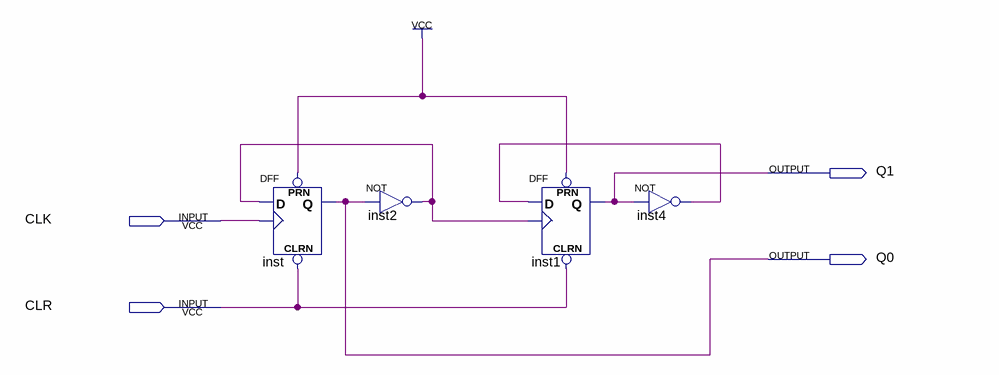
[diagram p0: schematic sheet]
// Quartus schematic 4-1counter.bdf as structural Verilog: 4 symbols, 4 pins
module \4-1counter  (
  input  CLK,
  input  CLR,
  output Q1,
  output Q0
);

  wire inst2_out, inst4_out;

  DFF inst (.CLRN(CLR), .CLK(CLK), .D(inst2_out), .PRN(1'b1), .Q(Q0));
  not inst2 (inst2_out, Q0);
  DFF inst1 (.CLRN(CLR), .CLK(inst2_out), .D(inst4_out), .PRN(1'b1), .Q(Q1));
  not inst4 (inst4_out, Q1);
endmodule
